# Altium project 2024_TCU.PrjPcb (part 2 of 2)

## Sheet IMU.SchDoc
size A; SheetNumber: 5; SheetTotal: 10
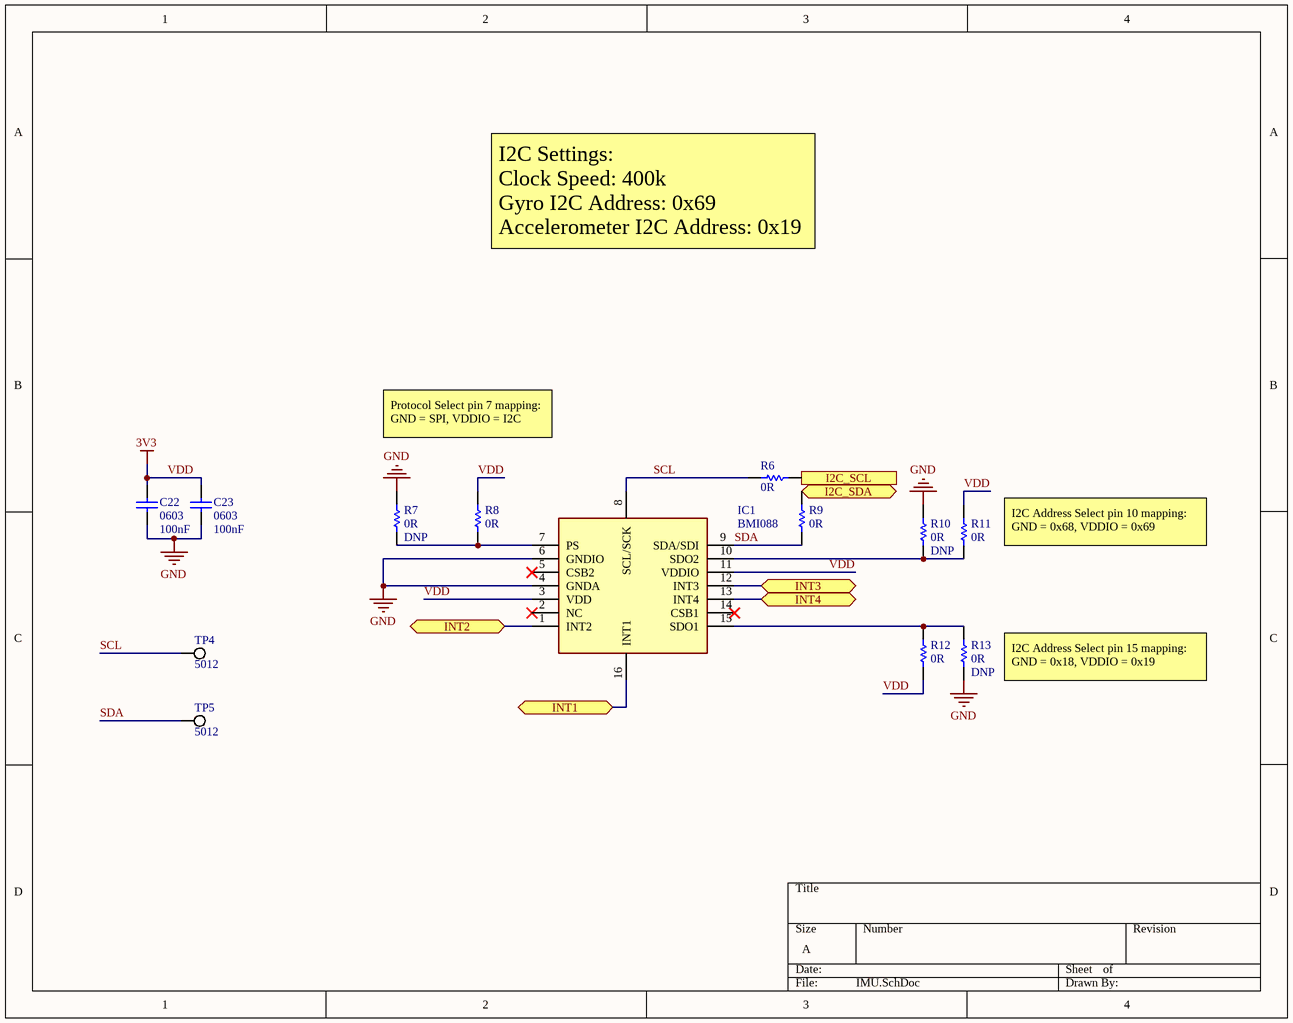
[diagram p7: IMU.SchDoc]

### Parts
C22  Case Code (Imperial): 0603  Capacitance: 100nF  [CAPC1608X87X35NL15T15]  (hidden comment: C0603X104K5RACTU)
C23  Case Code (Imperial): 0603  Capacitance: 100nF  [CAPC1608X87X35NL15T15]  (hidden comment: C0603X104K5RACTU)
IC1  BMI088  [BMI088]
R6  Resistance: 0R  [RESC2013X60X35LL10T20]  (hidden comment: RC0805JR-100RL)
R7  Resistance: 0R  [RESC2013X60X35LL10T20]  (hidden comment: RC0805JR-100RL)
R8  Resistance: 0R  [RESC2013X60X35LL10T20]  (hidden comment: RC0805JR-100RL)
R9  Resistance: 0R  [RESC2013X60X35LL10T20]  (hidden comment: RC0805JR-100RL)
R10  Resistance: 0R  [RESC2013X60X35LL10T20]  (hidden comment: RC0805JR-100RL)
R11  Resistance: 0R  [RESC2013X60X35LL10T20]  (hidden comment: RC0805JR-100RL)
R12  Resistance: 0R  [RESC2013X60X35LL10T20]  (hidden comment: RC0805JR-100RL)
R13  Resistance: 0R  [RESC2013X60X35LL10T20]  (hidden comment: RC0805JR-100RL)
TP4  5012  [KSTN-5012_V]
TP5  5012  [KSTN-5012_V]

### Ports
I2C_SCL (in, see TCU[2A], MainConnector[2C]), I2C_SDA (bidir, see TCU[2A], MainConnector[3B]), INT1 (bidir, see TCU[2A]), INT2 (bidir, see TCU[2A]), INT3 (bidir, see TCU[2A]), INT4 (bidir, see TCU[2A])

### Nets
3V3: C22.1 C23.1 IC1.3(VDD) IC1.11(VDDIO) R8.2 R11.2 R12.1  [also labelled VDD]  [project net AVDD33]
GND: C22.2 C23.2 IC1.4(GNDA) IC1.6(GNDIO) R7.2 R10.2 R13.1
SCL: IC1.8(SCL/SCK) R6.2 TP4.1
SDA: IC1.9(SDA/SDI) R9.1 TP5.1
NetIC1_1: IC1.1(INT2) ; port INT2
NetIC1_7: IC1.7(PS) R7.1 R8.1
NetIC1_10: IC1.10(SDO2) R10.1 R11.1
NetIC1_12: IC1.12(INT3) ; port INT3
NetIC1_13: IC1.13(INT4) ; port INT4
NetIC1_15: IC1.15(SDO1) R12.2 R13.2
NetIC1_16: IC1.16(INT1) ; port INT1
NetJ3_3: R6.1 ; port I2C_SCL
NetJ3_8: R9.2 ; port I2C_SDA

Not connected (* = marked no-connect by the designer): IC1 2(NC)* 5(CSB2)* 14(CSB1)*

### Notes on the sheet
- I2C Settings:
  Clock Speed: 400k
  Gyro I2C Address: 0x69
  Accelerometer I2C Address: 0x19
- Protocol Select pin 7 mapping:
  GND = SPI, VDDIO = I2C
- (near R11) I2C Address Select pin 10 mapping:
  GND = 0x68, VDDIO = 0x69
- (near R13) I2C Address Select pin 15 mapping:
  GND = 0x18, VDDIO = 0x19

### Library data of the parts
C22 C23 = CMP-2006-03300-1: Manufacturer: Kemet; Dielectric Material: Ceramic; Tolerance: 10%; Voltage Rating: 50V; Dielectric: X7R; Dissipation Factor: 2.5%; Part Number: C0603X104K5RACTU; Supplier 1: Digi-Key; Supplier Part Number 1: 399-7969-1-ND; Manufacturer Part Number: C0603X104K5RACTU; Stock 1: 2206541; Pricing 1: 1 = 0.21000, 10 = 0.14500, 100 = 0.07340, 500 = 0.05024, 1000 = 0.04444 (USD); RoHS: Yes; Mount: Surface Mount; Case/Package: 0603; Number of Pins: 2; Case Code (Metric): 1608; Min Operating Temperature: -55°C; Max Operating Temperature: 125°C; Packaging: Tape and Reel; Package Quantity: 1; Voltage Rating (DC): 50V; Termination: SMD/SMT; Voltage: 50V; Features: Soft Termination; Length: 1.6mm; Height: 0.8mm; Width: 0.8mm; Depth: 0.8mm; Thickness: 0.034inch; Radiation Hardening: No; REACH SVHC: No SVHC; ComponentLink1URL: https://datasheet.ciiva.com/7823/1776088-7823908.pdf?src-supplier=Element14; ComponentLink1Description: https://datasheet.ciiva.com/7823/1776088-7823908.pdf?src-supplier=Element14; ComponentLink2URL: https://datasheet.ciiva.com/26948/getdatasheetpartid-385607-26948458.pdf?src-supplier=Verical; ComponentLink2Description: https://datasheet.ciiva.com/26948/getdatasheetpartid-385607-26948458.pdf?src-supplier=Verical; ComponentLink3URL: https://datasheet.ciiva.com/7823/1776088-7823909.pdf?src-supplier=Element14; ComponentLink3Description: https://datasheet.ciiva.com/7823/1776088-7823909.pdf?src-supplier=Element14; ComponentLink4URL: https://datasheet.ciiva.com/6279/kem-c1013-x7r-ft-cap-smd-6279993.pdf?src-supplier=Digi-Key; ComponentLink4Description: https://datasheet.ciiva.com/6279/kem-c1013-x7r-ft-cap-smd-6279993.pdf?src-supplier=Digi-Key; ComponentLink5URL: https://datasheet.ciiva.com/28533/1918693-28533212.pdf?src-supplier=Element14; ComponentLink5Description: https://datasheet.ciiva.com/28533/1918693-28533212.pdf?src-supplier=Element14; ComponentLink6URL: https://datasheet.ciiva.com/6279/kem-c1013-x7r-ft-cap-smd-6279999.pdf?src-supplier=Digi-Key; ComponentLink6Description: https://datasheet.ciiva.com/6279/kem-c1013-x7r-ft-cap-smd-6279999.pdf?src-supplier=Digi-Key; ComponentLink7URL: https://datasheet.ciiva.com/6279/kem-c1013-x7r-ft-cap-smd-6279990.pdf?src-supplier=Digi-Key; ComponentLink7Description: https://datasheet.ciiva.com/6279/kem-c1013-x7r-ft-cap-smd-6279990.pdf?src-supplier=Digi-Key; ComponentLink8URL: https://datasheet.ciiva.com/14597/70096394-14597743.pdf?src-supplier=Allied+Electronics; ComponentLink8Description: https://datasheet.ciiva.com/14597/70096394-14597743.pdf?src-supplier=Allied+Electronics
IC1 = BMI088: Integrated Circuit; Manufacturer_Name: BOSCH; Datasheet Link: https://datasheet.datasheetarchive.com/originals/distributors/Datasheets_SAMA/994c3bf88e91a9e9fead6a819d348e4d.pdf; Height: 1.45mm; Manufacturer_Part_Number: BMI088; Mouser Part Number: 262-BMI088; Mouser Price/Stock: https://www.mouser.co.uk/ProductDetail/Bosch-Sensortec/BMI088?qs=f9yNj16SXrIMFspTV6RB6Q%3D%3D; Arrow Part Number: BMI088; Arrow Price/Stock: https://www.arrow.com/en/products/bmi088/bosch?region=europe; Supplier 1: Arrow Electronics; Supplier Part Number 1: BMI088
R6-R13 = CMP-2000-06963-1: Chip Resistor, 0 Ohm, +/- 5%, 125 mW, -55 to 155 degC, 0805 (2012 Metric), RoHS, Tape and Reel; Manufacturer: Yageo; Product Length (mm): 2mm; Tolerance (+ or -): NotRequired; Case Style: Molded; Product Height (mm): 0.5mm; Power Rating(s): NotRequiredW; Product Depth (mm): 1.25mm; Mounting Technology: SurfaceMount; Military Standard: NotRequired; Operating Temp Range: -55Cto155C; Temperature Coefficient: NotRequired; Package Description: 2-Pin Surface Mounted Device, Body 2 x 1.25 mm; Datasheet Version: Rev. 7, 05/2017; Failure Rate: NotRequired; Manufacturer URL: http://www.yageo.com/; Datasheet URL: http://www.yageo.com/documents/recent/PYu-RC_Group_51_RoHS_L_7.pdf; Packaging: TapeandReel; Package Reference: 0805; Package / Case: 0805; Termination Style: NotRequired; Type: ThickFilm; Construction: Rectangular
  R7 R10 R13: DNP: DNP
TP4 TP5 = CMP-1672-00004-4: Test Point, White, Through Hole, RoHS, Bulk; Manufacturer: Keystone; DatasheetVersion: Rev. F, 12/2013; ComponentLink1URL: http://www.keyelco.com/; PackageReference: 5012; RoHSCompliant: true; ComponentLink2Description: Datasheet; Colour: White; Contact Material: Bronze; PackageDescription: 1-Pin Through Hole Device, Dia 3.17 mm; Mounting Technology: Through Hole; Mount: Through Hole; Package Quantity: 100; ComponentLink1Description: Manufacturer URL; Pins: 1; Height: 8.12 mm; Packaging: Bulk; REACH SVHC: No SVHC; Contact Plating: Silver; Length: 11.3 mm; ComponentLink2URL: http://www.keyelco.com/product-pdf.cfm?p=1321

## Sheet Ethernet.SchDoc
size Legal; SheetNumber: 7; SheetTotal: 10
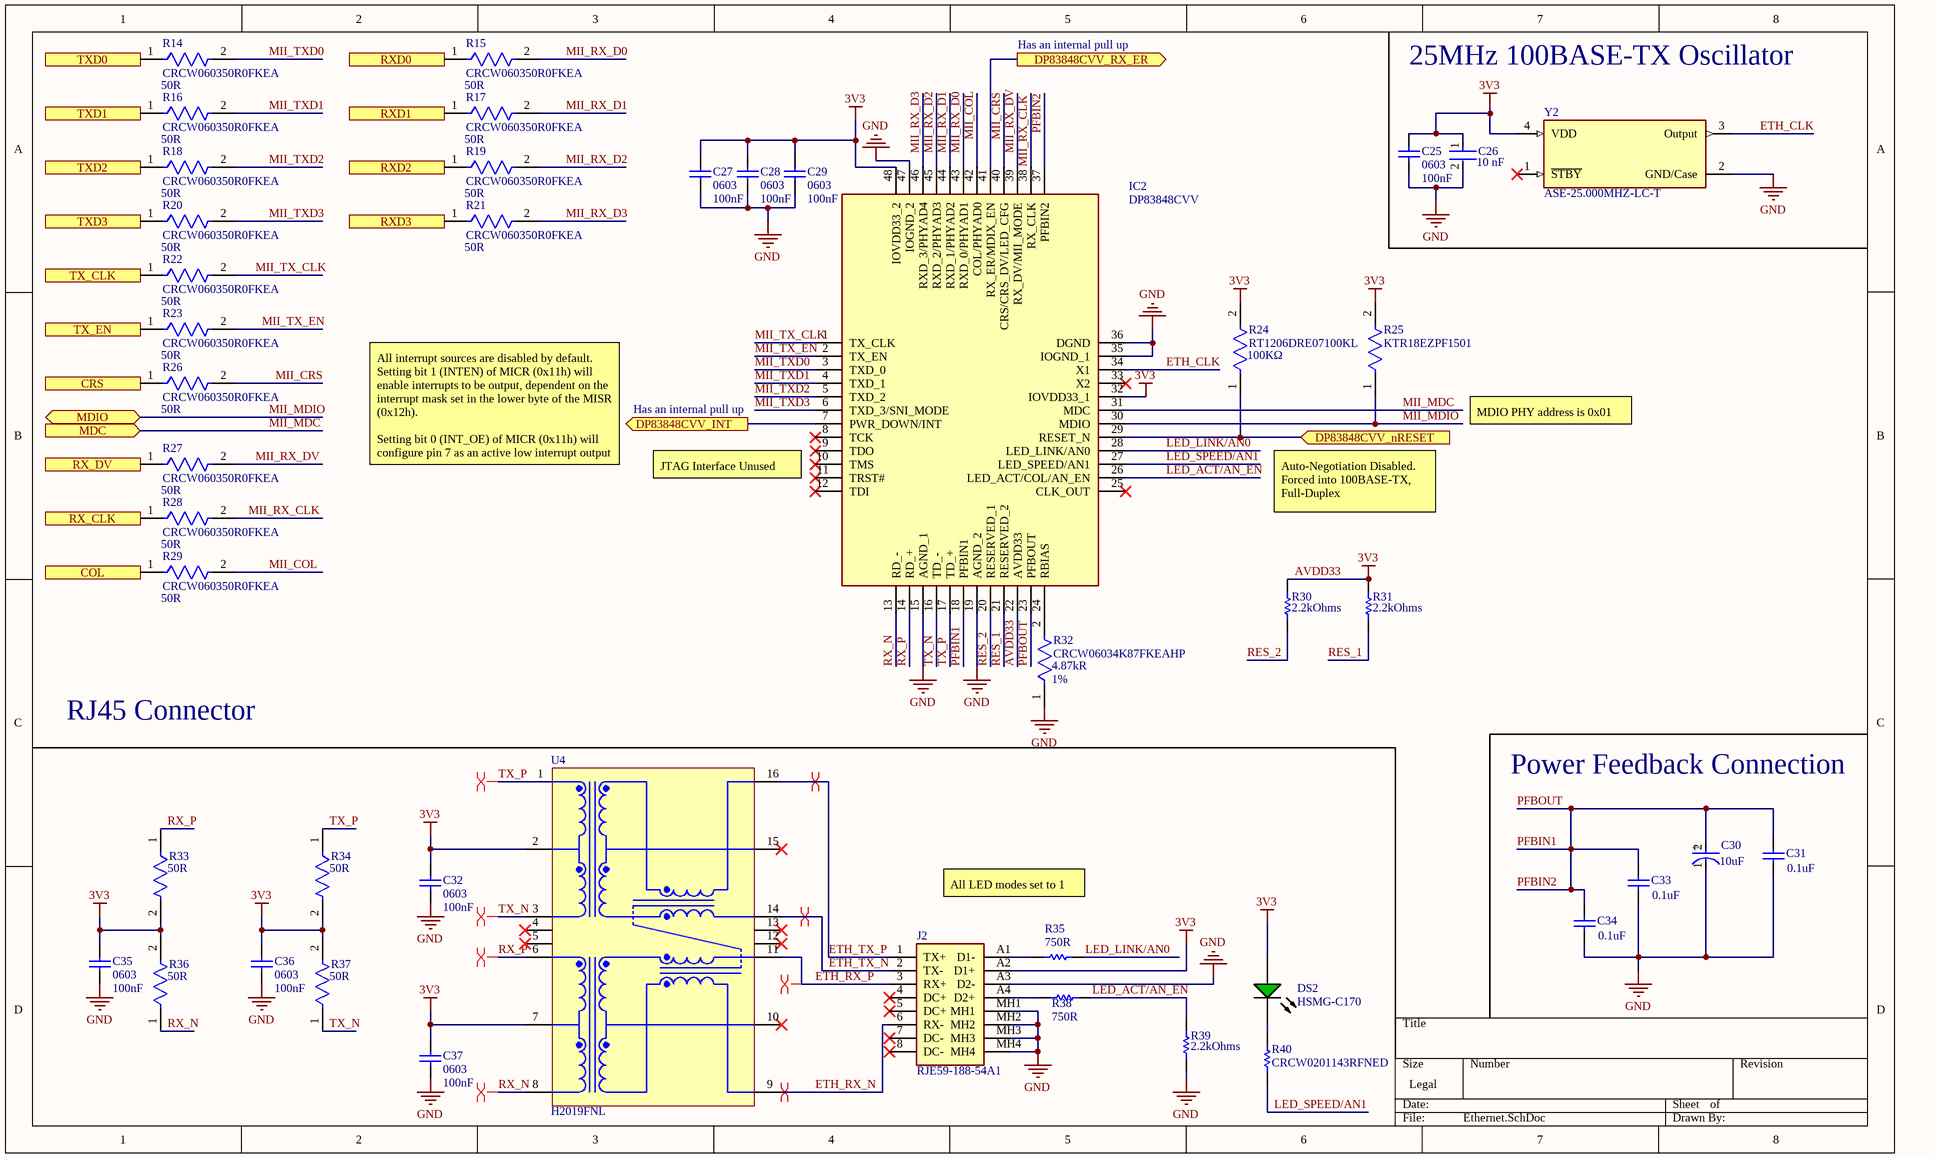
[diagram p8: Ethernet.SchDoc]

### Parts
C25  Case Code (Imperial): 0603  Capacitance: 100nF  [CAPC1608X87X35NL15T15]  (hidden comment: C0603X104K5RACTU)
C26  value 10 nF  [FP-CC0603-DA-MFG]  (hidden comment: CC0603KRX7R9BB103)
C27  Case Code (Imperial): 0603  Capacitance: 100nF  [CAPC1608X87X35NL15T15]  (hidden comment: C0603X104K5RACTU)
C28  Case Code (Imperial): 0603  Capacitance: 100nF  [CAPC1608X87X35NL15T15]  (hidden comment: C0603X104K5RACTU)
C29  Case Code (Imperial): 0603  Capacitance: 100nF  [CAPC1608X87X35NL15T15]  (hidden comment: C0603X104K5RACTU)
C30  Capacitance: 10uF  [FP-T491B106K025AT-MFG]  (hidden comment: T491B106K025AT)
C31  value 0.1uF  [CAPC2113X120X50NL20T30]  (hidden comment: TAJR104K020RNJ)
C32  Case Code (Imperial): 0603  Capacitance: 100nF  [CAPC1608X87X35NL15T15]  (hidden comment: C0603X104K5RACTU)
C33  value 0.1uF  [CAPC2113X120X50NL20T30]  (hidden comment: TAJR104K020RNJ)
C34  value 0.1uF  [CAPC2113X120X50NL20T30]  (hidden comment: TAJR104K020RNJ)
C35  Case Code (Imperial): 0603  Capacitance: 100nF  [CAPC1608X87X35NL15T15]  (hidden comment: C0603X104K5RACTU)
C36  Case Code (Imperial): 0603  Capacitance: 100nF  [CAPC1608X87X35NL15T15]  (hidden comment: C0603X104K5RACTU)
C37  Case Code (Imperial): 0603  Capacitance: 100nF  [CAPC1608X87X35NL15T15]  (hidden comment: C0603X104K5RACTU)
DS2  HSMG-C170  [AVAG-HSMX-C170_V]
IC2  DP83848CVV  [QFP50P900X900X160-48N]
J2  RJE59-188-54A1  [RJE5918854A1]
R14  CRCW060350R0FKEA  Resistance: 50R  [FP-CRCW0603-e3-MFG]
R15  CRCW060350R0FKEA  Resistance: 50R  [FP-CRCW0603-e3-MFG]
R16  CRCW060350R0FKEA  Resistance: 50R  [FP-CRCW0603-e3-MFG]
R17  CRCW060350R0FKEA  Resistance: 50R  [FP-CRCW0603-e3-MFG]
R18  CRCW060350R0FKEA  Resistance: 50R  [FP-CRCW0603-e3-MFG]
R19  CRCW060350R0FKEA  Resistance: 50R  [FP-CRCW0603-e3-MFG]
R20  CRCW060350R0FKEA  Resistance: 50R  [FP-CRCW0603-e3-MFG]
R21  CRCW060350R0FKEA  Resistance: 50R  [FP-CRCW0603-e3-MFG]
R22  CRCW060350R0FKEA  Resistance: 50R  [FP-CRCW0603-e3-MFG]
R23  CRCW060350R0FKEA  Resistance: 50R  [FP-CRCW0603-e3-MFG]
R24  RT1206DRE07100KL  Resistance: 100KΩ  [FP-RT1206-MFG]
R25  KTR18EZPF1501  [FP-KTR18-IPC_C]
R26  CRCW060350R0FKEA  Resistance: 50R  [FP-CRCW0603-e3-MFG]
R27  CRCW060350R0FKEA  Resistance: 50R  [FP-CRCW0603-e3-MFG]
R28  CRCW060350R0FKEA  Resistance: 50R  [FP-CRCW0603-e3-MFG]
R29  CRCW060350R0FKEA  Resistance: 50R  [FP-CRCW0603-e3-MFG]
R30  Resistance: 2.2kOhms  [RESC1608X55X25LL10T15]  (hidden comment: RC0603FR-072K2L)
R31  Resistance: 2.2kOhms  [RESC1608X55X25LL10T15]  (hidden comment: RC0603FR-072K2L)
R32  CRCW06034K87FKEAHP  Tolerance: 1%  Resistance: 4.87kR  [FP-CRCW0603-HPe3-MFG]
R33  Resistance: 50R  [FP-CRCW0603-e3-MFG]  (hidden comment: CRCW060350R0FKEA)
R34  Resistance: 50R  [FP-CRCW0603-e3-MFG]  (hidden comment: CRCW060350R0FKEA)
R35  Resistance: 750R  [RESC1609X50X30ML10T20]  (hidden comment: CRCW0603750RJNEA)
R36  Resistance: 50R  [FP-CRCW0603-e3-MFG]  (hidden comment: CRCW060350R0FKEA)
R37  Resistance: 50R  [FP-CRCW0603-e3-MFG]  (hidden comment: CRCW060350R0FKEA)
R38  Resistance: 750R  [RESC1609X50X30ML10T20]  (hidden comment: CRCW0603750RJNEA)
R39  Resistance: 2.2kOhms  [RESC1608X55X25LL10T15]  (hidden comment: RC0603FR-072K2L)
R40  CRCW0201143RFNED  [RESC0603X28X15ML05T05]
U4  H2019FNL  [PULS-H2019FNL_V]
Y2  ASE-25.000MHZ-LC-T  [FP-ASE-MFG]

### Ports
COL (out, see TCU[2C]), CRS (out, see TCU[2C]), DP83848CVV_INT (out, see TCU[2D], Processor[3C]), DP83848CVV_nRESET (in, see TCU[2D], Processor[2D]), DP83848CVV_RX_ER (out, see TCU[2D], Processor[2A]), MDC (in, see TCU[2C]), MDIO (bidir, see TCU[2C]), RX_CLK (out, see TCU[2C]), RX_DV (out, see TCU[2C]), RXD0 (out, see TCU[2C]), RXD1 (out, see TCU[2C]), RXD2 (out, see TCU[2D]), RXD3 (out, see TCU[2D]), TX_CLK (out, see TCU[2C]), TX_EN (in, see TCU[2C]), TXD0 (in, see TCU[2C]), TXD1 (in, see TCU[2C]), TXD2 (in, see TCU[2C]), TXD3 (in, see TCU[2C])

### Nets
AVDD33: C25.1 C26.1 C27.1 C28.1 C29.1 C32.1 C35.1 C36.1 C37.1 DS2.1(A) IC2.22(AVDD33) IC2.32(IOVDD33_1) IC2.48(IOVDD33_2) J2.A2(D1+) R24.2 R25.2 R30.2 R31.2 R33.2 R34.2 R36.2 R37.2 U4.2(TCT) U4.7(RCT) Y2.4(VDD)  [also labelled 3V3]
GND: C25.2 C26.2 C27.2 C28.2 C29.2 C30.1(C) C31.1 C32.2 C33.1 C34.1 C35.2 C36.2 C37.2 IC2.15(AGND_1) IC2.19(AGND_2) IC2.35(IOGND_1) IC2.36(DGND) IC2.47(IOGND_2) J2.A3(D2-) J2.MH1 J2.MH2 J2.MH3 J2.MH4 R32.1 R39.1 Y2.2(GND/Case)
ETH_CLK: IC2.34(X1) Y2.3(Output)
ETH_RX_N: J2.6(RX-) U4.9(RX-)
ETH_RX_P: J2.3(RX+) U4.11(RX+)
ETH_TX_N: J2.2(TX-) U4.14(TX-)
ETH_TX_P: J2.1(TX+) U4.16(TX+)
LED_ACT/AN_EN: IC2.26(LED_ACT/COL/AN_EN) R38.2 R39.2
LED_LINK/AN0: IC2.28(LED_LINK/AN0) R35.2
LED_SPEED/AN1: IC2.27(LED_SPEED/AN1) R40.1
MII_COL: IC2.42(COL/PHYAD0) R29.2
MII_CRS: IC2.40(CRS/CRS_DV/LED_CFG) R26.2
MII_MDC: IC2.31(MDC) ; port MDC
MII_MDIO: IC2.30(MDIO) R25.1 ; port MDIO
MII_RX_CLK: IC2.38(RX_CLK) R28.2
MII_RX_D0: IC2.43(RXD_0/PHYAD1) R15.2
MII_RX_D1: IC2.44(RXD_1/PHYAD2) R17.2
MII_RX_D2: IC2.45(RXD_2/PHYAD3) R19.2
MII_RX_D3: IC2.46(RXD_3/PHYAD4) R21.2
MII_RX_DV: IC2.39(RX_DV/MII_MODE) R27.2
MII_TX_CLK: IC2.1(TX_CLK) R22.2
MII_TX_EN: IC2.2(TX_EN) R23.2
MII_TXD0: IC2.3(TXD_0) R14.2
MII_TXD1: IC2.4(TXD_1) R16.2
MII_TXD2: IC2.5(TXD_2) R18.2
MII_TXD3: IC2.6(TXD_3/SNI_MODE) R20.2
PFBIN1: C30.2(A) C31.2 C33.2 C34.2 IC2.18(PFBIN1) IC2.23(PFBOUT) IC2.37(PFBIN2)  [also labelled PFBIN2, PFBOUT]
RES_1: IC2.21(RESERVED_2) R31.1
RES_2: IC2.20(RESERVED_1) R30.1
RX_N: IC2.13(RD_-) R36.1 U4.8(RD-)
RX_P: IC2.14(RD_+) R33.1 U4.6(RD+)
TX_N: IC2.16(TD_-) R37.1 U4.3(TD-)
TX_P: IC2.17(TD_+) R34.1 U4.1(TD+)
NetDS2_2: DS2.2(K) R40.2
NetIC2_7: IC2.7(PWR_DOWN/INT) ; port DP83848CVV_INT
NetIC2_24: IC2.24(RBIAS) R32.2
NetIC2_29: IC2.29(RESET_N) R24.1 ; port DP83848CVV_nRESET
NetIC2_41: IC2.41(RX_ER/MDIX_EN) ; port DP83848CVV_RX_ER
NetJ2_A1: J2.A1(D1-) R35.1
NetJ2_A4: J2.A4(D2+) R38.1
NetR14_1: R14.1 ; port TXD0
NetR15_1: R15.1 ; port RXD0
NetR16_1: R16.1 ; port TXD1
NetR17_1: R17.1 ; port RXD1
NetR18_1: R18.1 ; port TXD2
NetR19_1: R19.1 ; port RXD2
NetR20_1: R20.1 ; port TXD3
NetR21_1: R21.1 ; port RXD3
NetR22_1: R22.1 ; port TX_CLK
NetR23_1: R23.1 ; port TX_EN
NetR26_1: R26.1 ; port CRS
NetR27_1: R27.1 ; port RX_DV
NetR28_1: R28.1 ; port RX_CLK
NetR29_1: R29.1 ; port COL

Not connected (* = marked no-connect by the designer): IC2 8(TCK)* 9(TDO)* 10(TMS)* 11(TRST#)* 12(TDI)* 25(CLK_OUT)* 33(X2)*; J2 4(DC+)* 5(DC+)* 7(DC-)* 8(DC-)*; U4 4(NC)* 5(NC)* 10(RXCT)* 12(NC)* 13(NC)* 15(TXCT)*; Y2 1(~{STBY})*

### Layout directives
differential pair: ETH_RX_N, ETH_RX_P, ETH_TX_N, ETH_TX_P, RX_N, RX_P, TX_N, TX_P

### Notes on the sheet
- Has an internal pull up
- 25MHz 100BASE-TX Oscillator
- MDIO PHY address is 0x01
- All interrupt sources are disabled by default. Setting bit 1 (INTEN) of MICR (0x11h) will enable interrupts to be output, dependent on the interrupt mask set in the lower byte of the MISR (0x12h).
  Setting bit 0 (INT_OE) of MICR (0x11h) will configure pin 7 as an active low interrupt output
- (near IC2) JTAG Interface Unused
- Auto-Negotiation Disabled. Forced into 100BASE-TX, Full-Duplex
- RJ45 Connector
- Power Feedback Connection
- All LED modes set to 1
- (in symbol CMP-03017-000036-1) +

### Library data of the parts
C25 C27-C29 C32 C35-C37 = CMP-2006-03300-1: as C22 on sheet IMU; Part Number: C0603X104K5RACTU; Supplier 1: Digi-Key; Supplier Part Number 1: 399-7969-1-ND; Manufacturer Part Number: C0603X104K5RACTU; Stock 1: 2206541; Pricing 1: 1 = 0.21000, 10 = 0.14500, 100 = 0.07340, 500 = 0.05024, 1000 = 0.04444 (USD); RoHS: Yes; Mount: Surface Mount; Case/Package: 0603; Number of Pins: 2; Case Code (Metric): 1608; Min Operating Temperature: -55°C; Max Operating Temperature: 125°C; Packaging: Tape and Reel; Package Quantity: 1; Voltage Rating (DC): 50V; Termination: SMD/SMT; Voltage: 50V; Features: Soft Termination; Length: 1.6mm; Height: 0.8mm; Width: 0.8mm; Depth: 0.8mm; Thickness: 0.034inch; Radiation Hardening: No; REACH SVHC: No SVHC; ComponentLink1URL: https://datasheet.ciiva.com/7823/1776088-7823908.pdf?src-supplier=Element14; ComponentLink1Description: https://datasheet.ciiva.com/7823/1776088-7823908.pdf?src-supplier=Element14; ComponentLink2URL: https://datasheet.ciiva.com/26948/getdatasheetpartid-385607-26948458.pdf?src-supplier=Verical; ComponentLink2Description: https://datasheet.ciiva.com/26948/getdatasheetpartid-385607-26948458.pdf?src-supplier=Verical; ComponentLink3URL: https://datasheet.ciiva.com/7823/1776088-7823909.pdf?src-supplier=Element14; ComponentLink3Description: https://datasheet.ciiva.com/7823/1776088-7823909.pdf?src-supplier=Element14; ComponentLink4URL: https://datasheet.ciiva.com/6279/kem-c1013-x7r-ft-cap-smd-6279993.pdf?src-supplier=Digi-Key; ComponentLink4Description: https://datasheet.ciiva.com/6279/kem-c1013-x7r-ft-cap-smd-6279993.pdf?src-supplier=Digi-Key; ComponentLink5URL: https://datasheet.ciiva.com/28533/1918693-28533212.pdf?src-supplier=Element14; ComponentLink5Description: https://datasheet.ciiva.com/28533/1918693-28533212.pdf?src-supplier=Element14; ComponentLink6URL: https://datasheet.ciiva.com/6279/kem-c1013-x7r-ft-cap-smd-6279999.pdf?src-supplier=Digi-Key; ComponentLink6Description: https://datasheet.ciiva.com/6279/kem-c1013-x7r-ft-cap-smd-6279999.pdf?src-supplier=Digi-Key; ComponentLink7URL: https://datasheet.ciiva.com/6279/kem-c1013-x7r-ft-cap-smd-6279990.pdf?src-supplier=Digi-Key; ComponentLink7Description: https://datasheet.ciiva.com/6279/kem-c1013-x7r-ft-cap-smd-6279990.pdf?src-supplier=Digi-Key; ComponentLink8URL: https://datasheet.ciiva.com/14597/70096394-14597743.pdf?src-supplier=Allied+Electronics; ComponentLink8Description: https://datasheet.ciiva.com/14597/70096394-14597743.pdf?src-supplier=Allied+Electronics
C26 = CMP-2100-03600-2: CAP CER 10000PF 50V X7R 0603; Manufacturer: YAGEO; Tolerance: 0.1; Material: Ceramic; Temperature Coefficient: 15%; Mouser Description: Multilayer Ceramic Capacitor, CC Series, 0.01 - F, - 10%, X7R, 50 V, 0603 [1608 Metric]; Digikey Description: CAP CER 10000PF 50V X7R 0603; Height: 0.9mm; Category: Cap; Temperature Characteristic: X7R; Footprint Url: http://www.yageo.com/exep/pages/download/literatures/UPY-C_GEN_24.pdf; Lead Free: Yes; Voltage Rating: 50 V; Manufacturer Part Number: CC0603KRX7R9BB103; Temperature: -55°C to +125°C; Device Class L3: Ceramic Capacitors; ComponentLink2Description: Datasheet; Voltage: 50 V; Package: CC0603-DA; Octopart: https://octopart.com/cc0603krx7r9bb103-yageo-192938; Automotive: No; Temperature Range High: +125°C; Temperature Range Low: -55°C; RoHS: TRUE; Device Class L1: Passive Components; ComponentLink2URL: http://www.yageo.com/documents/recent/UPY-GPHC_X7R_6.3V-to-50V_18.pdf; Device Class L2: Capacitors; Capacitance: 10 nF
C30 = CMP-03017-000036-1: CAP TANT 10UF 10% 25V 1411; Life (Hours): 2000Hour; Leakage Current: 2.5uA; ESR (Equivalent Series Resistance): 3R; Ripple Current: 168mA; Polarity: Polar; Dielectric Material: Tantalum; Dissipation Factor: 8%; Package Quantity: 1; Series: T491; Features: General Purpose; Lead Free: Lead Free; Termination: SMD/SMT; Packaging: Tape and Reel; Max Operating Temperature: 125°C; Number of Pins: 2; Case Code (Imperial): 1411; Height - Seated (Max): 0.083inch; Min Operating Temperature: -55°C; Case/Package: 1411; Voltage: 25V; Tolerance: 10%; REACH SVHC: No SVHC; Case Code (Metric): 3528; Depth: 2.8mm; Mount: Surface Mount; Voltage Rating (DC): 25V; Length: 3.5mm; Voltage Rating: 25V; Construction: Flat; RoHS Compliant: Yes; Height: 1.9mm; Width: 0.11inch; Radiation Hardening: No
C31 C33 C34 = CMP-2007-04027-1: Manufacturer: AVX Interconnect / Elco; Part Number: TAJR104K020RNJ
DS2 = CMP-2000-05062-1: Chip LED, Green, 2.2 V, -40 to 85 degC, 2-Pin SMD, Pb-Free, Tape and Reel; Manufacturer: Avago; No. of Pins: 2; Peak Wavelength: 570nm; SVHC: NoSVHC(16-Jun-2014); Dominant Wavelength: 572nm; Forward Current If: 20mA; Viewing Angle: 170deg; Lens Shape: Rectangular; PIV Max: 5V; External Width: 1.25mm; LED Type: Standard; External Depth: 0.8mm; Opto Mounting Orientation: Top; Luminous Intensity: 15mcd; Luminous Intensity Min: 4mcd; Forward Voltage VF Max: 2.6V; External Length / Height: 2mm; Bulb Size: 1.25mmx1.4mm; Light Area Height: 1mm; Voltage Vf Typ: 2.2V; Operating Temperature Max: 85degC; Datasheet Version: Oct-08; MSL: MSL2A-4weeks; Peak Forward Current: 20mA; Package Description: 2-Pin Surface Mount Device, Body 2 x 1.25 mm, Height 0.8 mm; Datasheet URL: https://datasheet.ciiva.com/29280/180495-da-01-en-chip-led-hsmg-c170-gelb-gruen-29280971.pdf; Storage Temperature Min: -40degC; LED Colour: Green; Wavelength Typ: 570nm; Mounting Type: SMD; Forward Current If Max: 20mA; Dominant Wavelength Typ: 572nm; LED Mounting: SMD; Operating Temperature Range: -30degCto+85degC; Operating Temperature Min: -30degC; Manufacturer URL: http://www.avagotech.com/; Packaging: CutTape; Luminous Intensity Typ: 15mcd; Package Reference: HSMX-C170; Storage Temperature Max: 85degC; Opto Case Style: SMD; Forward Voltage: 2.2V
IC2 = DP83848CVV: Integrated Circuit; Manufacturer_Name: Texas Instruments; Datasheet Link: https://www.ti.com/lit/ds/symlink/dp83848c.pdf?ts=1623408916131&ref_url=https%253A%252F%252Fwww.ti.com%252Fstore%252Fti%252Fen%252Fp%252Fproduct%252F%253Fp%253DDP83848CVV%252FNOPB; Height: 1.6mm; Manufacturer_Part_Number: DP83848CVV; Mouser Part Number: N/A; Mouser Price/Stock: https://www.mouser.co.uk/ProductDetail/Texas-Instruments/DP83848CVV?qs=7X5t%252BdzoRHD7qwP%2FAptr%2Fg%3D%3D; Supplier 1: Mouser; Supplier Part Number 1: 926-DP83848CVV/NOPB
J2 = RJE59-188-54A1: Connector; Manufacturer_Name: Amphenol; Datasheet Link: https://datasheet.datasheetarchive.com/originals/distributors/DKDS-29/572439.pdf; Height: 14.99mm; Manufacturer_Part_Number: RJE59-188-54A1; Mouser Part Number: 523-RJE59-188-54A1; Mouser Price/Stock: https://www.mouser.co.uk/ProductDetail/Amphenol-Commercial-Products/RJE59-188-54A1?qs=cbcdnthhinTKLWQ%2FS%2FbVLA%3D%3D; Supplier 1: Avnet; Supplier Part Number 1: 92Y3914
R14-R23 R26-R29 R33 R34 R36 R37 = CMP-2000-03436-2: RES Thick Film, 50Ω, 1%, 0.1W, 100ppm/°C, 0603; Voltage Rating (DC): 75V; Power Rating: 100mW; Case/Package: 0603; Packaging: Tape and Reel; Military Standard: Not; REACH SVHC: No SVHC; Width: 0.85mm; Max Operating Temperature: 155°C; Case Code (Metric): 1608; Temperature Coefficient: 100ppm/°C; Lead Free: Lead Free; Height: 0.45mm; Composition: Thick Film; Termination: SMD/SMT; Contact Plating: Tin; Number of Pins: 2; Tolerance: 1%; Depth: 0.85mm; Weight: 7.1E-05oz; Min Operating Temperature: -55°C; Length: 1.55mm; Radiation Hardening: No; Voltage Rating: 75V; Case Code (Imperial): 0603; Package Quantity: 5000; Mount: Surface Mount
R24 = CMP-2003-04271-2: RES SMD 100K OHM 0.5% 1/4W 1206; Manufacturer: Yageo; Value: 100KΩ; Power Rating: 0.25W; Tolerance: 0.0001; Temperature Coefficient: 50 ppm/°C; Voltage Rating: 200V; Mouser Description: Res Thin Film 1206 100K Ohm 0.5% 1/4W ±50ppm/°C Molded SMD Paper T/R; Series: RT; RoHS: TRUE; Device Class L3: Chip SMD Resistors; Ipc Land Pattern Name: RESC310160X55; Lead Free: Yes; Package: RT1206; Height: 0.65mm; Composition: Thin Film; Temperature Range Low: -55°C; Device Class L2: Resistors; Octopart: https://octopart.com/rt1206dre07100kl-yageo-1189867; ComponentLink2Description: Datasheet; ComponentLink2URL: http://www.yageo.com/documents/recent/PYu-RT_1-to-0.01_RoHS_L_9.pdf; Digikey Description: RES SMD 100K OHM 0.5% 1/4W 1206; Manufacturer Part Number: RT1206DRE07100KL; Temperature Range High: +155°C; Automotive: No; Temperature: -55°C to +155°C; Device Class L1: Passive Components; Footprint Url: http://www.yageo.com/exep/pages/download/literatures/PYu-R_Mount_10.pdf; Category: Res
R25 = CMP-08839-031800-1: Res Thick Film 1206 1.5kΩ 1% 0.1W ±100ppm/°C Automotive Paper T/R; Resistance: 1.5kR; Max Power Dissipation: 250mW; Width: 0.063inch; Length: 0.126inch; Case Code (Imperial): 1206; Max Operating Temperature: 155°C; Package Quantity: 1; Case Code (Metric): 3216; RoHS Compliant: Yes; Features: Automotive AEC-Q200; Height: 0.026inch; Min Operating Temperature: -55°C; Series: KTR; Resistor Type: Thick Film; Temperature Coefficient: 100ppm/°C; Packaging: Tape and Reel; Number of Terminations: 2; Tolerance: 1%; Case/Package: 1206
R30 R31 R39 = CMP-2000-06934-1: Thick Film Resistor, 2.2 KOhm, 100 mW, 50 V, +/- 1%, -55 to 155 degC, 2-Pin SMD (0603), RoHS, Tape and Reel; Manufacturer: Yageo; Temperature Coefficient: 100PPM/C; Voltage Rating: 50V; Power Rating: 100mW; Tolerance: 1%; Datasheet Version: Rev. 7, 05/2017; Case Code - mm: 1608; Series: RC; Mounting Technology: SurfaceMount; Package Description: 2-Pin Surface Mount Device, Body 1.6 x 0.8 mm; Case Code - in: 0603; Package Reference: 0603; Product: ThickFilmResistorsGeneralPurpose; Manufacturer URL: http://www.yageo.com/; Termination Style: SMD/SMT; Operating Temperature Range: -55Cto+155C; Datasheet URL: http://www.yageo.com/documents/recent/PYu-RC_Group_51_RoHS_L_7.pdf; Packaging: Reel
R32 = CMP-02407-007715-1: RES Thick Film, 4.87kΩ, 1%, 0.33W, 100ppm/°C, 0603; Max Power Dissipation: 250mW; Package Quantity: 5000; Height: 0.022inch; Number of Terminations: 2; Termination: Wraparound; Min Operating Temperature: -55°C; Lead Free: Lead Free; Power Rating: 250mW; Features: Automotive AEC-Q200; Mount: Surface Mount; Temperature Coefficient: 100ppm/°C; Width: 0.033inch; Length: 0.063inch; Packaging: Tape and Reel; Case/Package: 0603; Max Operating Temperature: 155°C; Contact Plating: Tin; Composition: Thick Film
R35 R38 = CMP-2000-03570-1: Manufacturer: Vishay Dale; Part Number: CRCW0603750RJNEA
R40 = CMP-2004-00107-1: Manufacturer: Vishay Dale; Part Number: CRCW0201143RFNED
U4 = CMP-2000-06384-1: Telecom Transformer, 100BASE-TX, 0 to 70 degC, 16-Pin SMD, RoHS; Manufacturer: Pulse Electronics; Other Names: 553-2199; Other Related Documents: PackagesFNLvs.NL; Mounting Technology: SurfaceMount; Manufacturer URL: http://www.pulseelectronics.com/; Package Description: 16-Pin Surface Mount Device, Body 12.7 x 9.09 mm, Pitch 1.27 mm; Package Reference: H2019FNL; Standard Package: 40; Datasheet Version: Rev. A, 06/2014; Category: Transformers; Family: PulseTransformers; Datasheet URL: http://productfinder.pulseeng.com/products/datasheets/H2019FNL.pdf
Y2 = CMP-2000-05795-3: XTAL Oscillator 25MHz ±50ppm CMOS 3.3V 4-SMD 3.2mm x 2.5mm; Load Capacitance: 15pF; Min Supply Voltage: 3.135V; Max Supply Voltage: 3.465V; Max Supply Current: 13mA; Max Operating Temperature: 85°C; Termination: SMD/SMT; Operating Frequency: 25 MHz; Height: 0.047inch; Frequency: 25MHz; Mount: Surface Mount; Number of Pins: 4; Length: 3.2mm; Packaging: Tape and Reel; Frequency Stability: 50ppm; Series: ASE; Radiation Hardening: No; Package Quantity: 1000; Width: 2.5mm; Min Operating Temperature: -40°C; Lead Free: Lead Free; Case/Package: SMD/SMT; Depth: 2.5mm; Operating Supply Voltage: 3.3V

## Sheet Power.SchDoc
size A; SheetNumber: 10; SheetTotal: 10
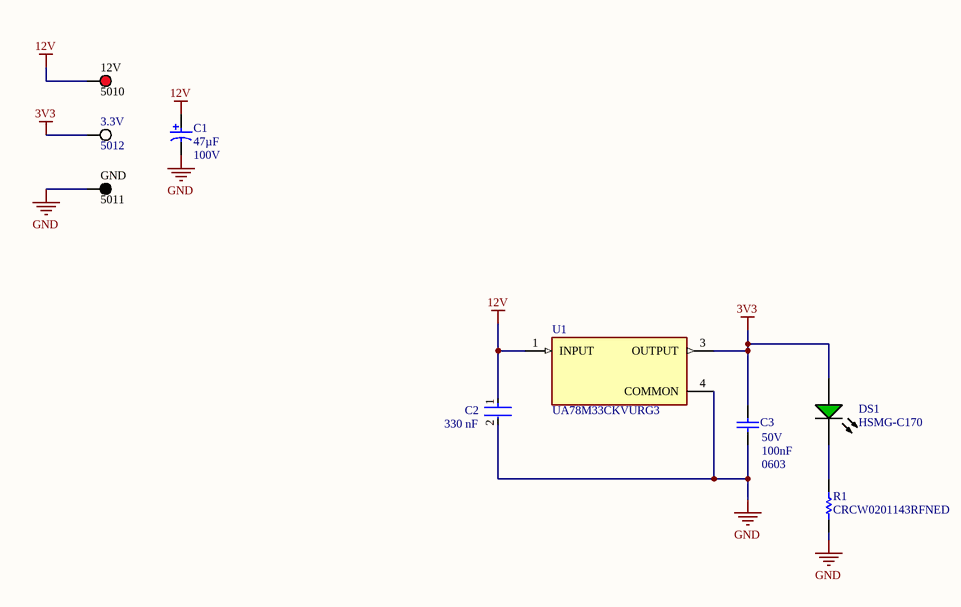
[diagram p9: Power.SchDoc]

### Parts
3.3V  5012  [KSTN-5012_V]
12V  5010  [KSTN-5010_V]
C1  Capacitance: 47µF  Voltage: 100V  [NIC-UUX2A470MNL1GS_L]  (hidden comment: UUX2A470MNL1GS)
C2  value 330 nF  [FP-CC0805-0_85-MFG]  (hidden comment: CC0805KKX7R7BB334)
C3  Case Code (Imperial): 0603  Capacitance: 100nF  Voltage: 50V  [CAPC1608X87X35NL15T15]  (hidden comment: C0603X104K5RACTU)
DS1  HSMG-C170  [AVAG-HSMX-C170_V]
GND  5011  [KSTN-5011_V]
R1  CRCW0201143RFNED  [RESC0603X28X15ML05T05]
U1  UA78M33CKVURG3  [FP-KVU0003A-MFG]

### Nets
3V3: 3.3V.1 C3.2 DS1.1(A) U1.3(OUTPUT)  [project net AVDD33]
12V: 12V.1 C1.1 C2.1 U1.1(INPUT)
GND: C1.2 C2.2 C3.1 GND.1 R1.1 U1.4(COMMON)
NetDS1_2: DS1.2(K) R1.2

### Library data of the parts
3.3V = CMP-1672-00004-4: as TP4 on sheet IMU; DatasheetVersion: Rev. F, 12/2013; ComponentLink1URL: http://www.keyelco.com/; PackageReference: 5012; RoHSCompliant: true; ComponentLink2Description: Datasheet; Colour: White; Contact Material: Bronze; PackageDescription: 1-Pin Through Hole Device, Dia 3.17 mm; Mounting Technology: Through Hole; Mount: Through Hole; Package Quantity: 100; ComponentLink1Description: Manufacturer URL; Pins: 1; Height: 8.12 mm; Packaging: Bulk; REACH SVHC: No SVHC; Contact Plating: Silver; Length: 11.3 mm; ComponentLink2URL: http://www.keyelco.com/product-pdf.cfm?p=1321
12V = CMP-1672-00002-4: Test Point, Red, Through Hole, RoHS, Bulk; Manufacturer: Keystone; Contact Material: Bronze; Mounting Technology: Through Hole; RoHSCompliant: true; Pins: 1; Package Quantity: 100; ComponentLink2Description: Datasheet; Height: 8.12 mm; ComponentLink1URL: http://www.keyelco.com/; DatasheetVersion: Rev. F, 12/2013; Mount: Through Hole; PackageReference: 5010; Contact Plating: Silver; Packaging: Bulk; Colour: Red; REACH SVHC: No SVHC; PackageDescription: 1-Pin Through Hole Device, Dia 3.17 mm; ComponentLink2URL: http://www.keyelco.com/product-pdf.cfm?p=1319; ComponentLink1Description: Manufacturer URL
C1 = CMP-2000-07372-1: Aluminum Electrolytic Capacitor, 47 uF, +/- 20%, 100 VDC, -55 to 105 degC, 2-Pin SMD, RoHS, Tape and Reel; Manufacturer: Nichicon; Type: Can; Leakage Current: 141uA; Dissipation Factor: 0.08%; Ripple Current: 230mA; Life (Hours): 2000Hour; Lead Diameter: 1.1mm; Dielectric Material: Aluminium; Polarity: Polarized; Tan Delta: 0.08; Package Description: 2-Pin Aluminum Electrolytic Capacitor, Body 10.3 x 10.3 mm; Datasheet Version: 08/2015; Case Size/Dimension: Ø10x10mm; Mounting Technology: SurfaceMount; Operating Temp-Max: 105°C; Datasheet URL: http://products.nichicon.co.jp/en/pdf/XJA043/e-uux.pdf; Manufacturer URL: http://www.nichicon.co.jp/english/; Package Reference: UUX2A470MNL1GS; Rated Voltage: 100V; Supplier 1: Digi-Key; Supplier Part Number 1: 493-9631-1-ND; Manufacturer Part Number: UUX2A470MNL1GS; Stock 1: 24372; Pricing 1: 1 = 0.720000, 10 = 0.507000, 100 = 0.333800 (USD); RoHS: Yes; Mount: Surface Mount; Case/Package: Radial; Min Operating Temperature: -55°C; Max Operating Temperature: 105°C; Tolerance: 20%; Packaging: Tape and Reel; Voltage Rating: 100V; Voltage Rating (DC): 100V; Termination: SMD/SMT; Package Quantity: 500; Ripple Current (AC): 230mA; Features: General Purpose; Diameter: 10mm; Length: 10mm; Height: 10mm; Height - Seated (Max): 0.394inch; Lead Pitch: 4.5mm; Radiation Hardening: No; REACH SVHC: No SVHC; Supplier 2: Digikey; Supplier Part Number 2: 493-9631-6-ND; Category: Aluminum Electrolytic Capacitors; Pricing 2: 1=0.65, 10=0.455, 50=0.383, 100=0.3118 (USD); Number of Pins: 2; Package Shape: Cylindrical; Size Code: 4141; Terminal Finish: Tin; JESD-609 Code: e6; Capacitor Type: Aluminium; Negative Tolerance: 20%; Package Style: SMTMeter; Positive Tolerance: 20%; Rated DC Voltage (URdc): 100V; Width: 10.3mm; Reach SVHC Compliant: No; RoHS Compliant: Yes; ComponentLink1URL: https://datasheet.ciiva.com:443/pdfs/VipMasterIC/IC/NICH/NICH-S-A0009252175/NICH-S-A0009252175-1.pdf?src-supplier=IHS+Markit; ComponentLink1Description: https://datasheet.ciiva.com:443/pdfs/VipMasterIC/IC/NICH/NICH-S-A0009252175/NICH-S-A0009252175-1.pdf?src-supplier=IHS+Markit; ComponentLink2URL: https://datasheet.ciiva.com/30522/getdatasheetpartid-544485-30522138.pdf?src-supplier=Verical; ComponentLink2Description: https://datasheet.ciiva.com/30522/getdatasheetpartid-544485-30522138.pdf?src-supplier=Verical; ComponentLink3URL: https://datasheet.ciiva.com/11781/0900766b80fa3a40-11781984.pdf?src-supplier=Rs; ComponentLink3Description: https://datasheet.ciiva.com/11781/0900766b80fa3a40-11781984.pdf?src-supplier=Rs; ComponentLink4URL: https://datasheet.ciiva.com/5361/e-ux-11104-5361317.pdf?src-supplier=Mouser; ComponentLink4Description: https://datasheet.ciiva.com/5361/e-ux-11104-5361317.pdf?src-supplier=Mouser; ComponentLink5URL: https://datasheet.ciiva.com/7907/e-ux-7907500.pdf?src-supplier=Element14; ComponentLink5Description: https://datasheet.ciiva.com/7907/e-ux-7907500.pdf?src-supplier=Element14; ComponentLink6URL: https://datasheet.ciiva.com/28458/1913003-28458341.pdf?src-supplier=Element14; ComponentLink6Description: https://datasheet.ciiva.com/28458/1913003-28458341.pdf?src-supplier=Element14
C2 = CMP-03422-000882-1: Surface Mount Ceramic Multilayer Capacitor 0.33uF 10% X7R 16V 0805 Blister T/R; Manufacturer: Yageo; Tolerance: 0.1; Height: 0.95mm; Automotive: No; Footprint Url: http://www.yageo.com/exep/pages/download/literatures/UPY-C_GEN_24.pdf; Temperature Characteristic: X7R; Device Class L3: Ceramic Capacitors; Category: Cap; Temperature Range High: +85°C; Manufacturer Part Number: CC0805KKX7R7BB334; Temperature Range Low: -30°C; ComponentLink2URL: http://www.yageo.com/documents/recent/UPY-GPHC_Y5V_6.3V-to-50V_8.pdf; Lead Free: Yes; Device Class L2: Capacitors; Package: CC0805-0.85; Material: Ceramic; Voltage Rating: 16 V; Device Class L1: Passive Components; Ipc Land Pattern Name: CAPC200125X85; Mouser Description: Multilayer Ceramic Capacitors MLCC - SMD/SMT 330nF 16V X7R 10%; Octopart: https://octopart.com/cc0805kkx7r7bb334-yageo-42334127; Capacitance: 330 nF; Temperature: -30°C to +85°C; ComponentLink2Description: Datasheet; Digikey Description: Surface Mount Ceramic Multilayer Capacitor 0.33uF 10% X7R 16V 0805 Blister T/R; RoHS: TRUE
C3 = CMP-2006-03300-1: Manufacturer: Kemet; Dielectric Material: Ceramic; Tolerance: 10%; Dielectric: X7R; Dissipation Factor: 2.5%; Part Number: C0603X104K5RACTU; Supplier 1: Digi-Key; Supplier Part Number 1: 399-7969-1-ND; Manufacturer Part Number: C0603X104K5RACTU; Stock 1: 2206541; Pricing 1: 1 = 0.21000, 10 = 0.14500, 100 = 0.07340, 500 = 0.05024, 1000 = 0.04444 (USD); RoHS: Yes; Mount: Surface Mount; Case/Package: 0603; Number of Pins: 2; Case Code (Metric): 1608; Min Operating Temperature: -55°C; Max Operating Temperature: 125°C; Voltage Rating: 50V; Packaging: Tape and Reel; Package Quantity: 1; Voltage Rating (DC): 50V; Termination: SMD/SMT; Features: Soft Termination; Length: 1.6mm; Height: 0.8mm; Width: 0.8mm; Depth: 0.8mm; Thickness: 0.034inch; Radiation Hardening: No; REACH SVHC: No SVHC; ComponentLink1URL: https://datasheet.ciiva.com/7823/1776088-7823908.pdf?src-supplier=Element14; ComponentLink1Description: https://datasheet.ciiva.com/7823/1776088-7823908.pdf?src-supplier=Element14; ComponentLink2URL: https://datasheet.ciiva.com/26948/getdatasheetpartid-385607-26948458.pdf?src-supplier=Verical; ComponentLink2Description: https://datasheet.ciiva.com/26948/getdatasheetpartid-385607-26948458.pdf?src-supplier=Verical; ComponentLink3URL: https://datasheet.ciiva.com/7823/1776088-7823909.pdf?src-supplier=Element14; ComponentLink3Description: https://datasheet.ciiva.com/7823/1776088-7823909.pdf?src-supplier=Element14; ComponentLink4URL: https://datasheet.ciiva.com/6279/kem-c1013-x7r-ft-cap-smd-6279993.pdf?src-supplier=Digi-Key; ComponentLink4Description: https://datasheet.ciiva.com/6279/kem-c1013-x7r-ft-cap-smd-6279993.pdf?src-supplier=Digi-Key; ComponentLink5URL: https://datasheet.ciiva.com/28533/1918693-28533212.pdf?src-supplier=Element14; ComponentLink5Description: https://datasheet.ciiva.com/28533/1918693-28533212.pdf?src-supplier=Element14; ComponentLink6URL: https://datasheet.ciiva.com/6279/kem-c1013-x7r-ft-cap-smd-6279999.pdf?src-supplier=Digi-Key; ComponentLink6Description: https://datasheet.ciiva.com/6279/kem-c1013-x7r-ft-cap-smd-6279999.pdf?src-supplier=Digi-Key; ComponentLink7URL: https://datasheet.ciiva.com/6279/kem-c1013-x7r-ft-cap-smd-6279990.pdf?src-supplier=Digi-Key; ComponentLink7Description: https://datasheet.ciiva.com/6279/kem-c1013-x7r-ft-cap-smd-6279990.pdf?src-supplier=Digi-Key; ComponentLink8URL: https://datasheet.ciiva.com/14597/70096394-14597743.pdf?src-supplier=Allied+Electronics; ComponentLink8Description: https://datasheet.ciiva.com/14597/70096394-14597743.pdf?src-supplier=Allied+Electronics
DS1 = CMP-2000-05062-1: as DS2 on sheet Ethernet; Operating Temperature Max: 85degC; Datasheet Version: Oct-08; MSL: MSL2A-4weeks; Peak Forward Current: 20mA; Package Description: 2-Pin Surface Mount Device, Body 2 x 1.25 mm, Height 0.8 mm; Datasheet URL: https://datasheet.ciiva.com/29280/180495-da-01-en-chip-led-hsmg-c170-gelb-gruen-29280971.pdf; Storage Temperature Min: -40degC; LED Colour: Green; Wavelength Typ: 570nm; Mounting Type: SMD; Forward Current If Max: 20mA; Dominant Wavelength Typ: 572nm; LED Mounting: SMD; Operating Temperature Range: -30degCto+85degC; Operating Temperature Min: -30degC; Manufacturer URL: http://www.avagotech.com/; Packaging: CutTape; Luminous Intensity Typ: 15mcd; Package Reference: HSMX-C170; Storage Temperature Max: 85degC; Opto Case Style: SMD; Forward Voltage: 2.2V
GND = CMP-1672-00003-4: Test Point, Black, Through Hole, RoHS, Bulk; Manufacturer: Keystone; ComponentLink2URL: http://www.keyelco.com/product-pdf.cfm?p=1320; Colour: Black; Pins: 1; REACH SVHC: No SVHC; ComponentLink1URL: http://www.keyelco.com/; PackageReference: 5011; Contact Plating: Silver; Package Quantity: 100; Packaging: Bulk; RoHSCompliant: true; Height: 8.12 mm; PackageDescription: 1-Pin Through Hole Device, Dia 3.17 mm; Mount: Through Hole; Mounting Technology: Through Hole; DatasheetVersion: Rev. F, 12/2013; ComponentLink1Description: Manufacturer URL; Contact Material: Bronze; ComponentLink2Description: Datasheet
R1 = CMP-2004-00107-1: Manufacturer: Vishay Dale; Part Number: CRCW0201143RFNED
U1 = CMP-04917-000046-1: IC REG LINEAR 3.3V 500MA TO252-3; Manufacturer: Texas Instruments; Nominal Supply Current: 4.5mA; Output Type: Fixed; Dropout Voltage: 2V; Number Of Outputs: 1; Max Supply Voltage: 25V; Standoff Height: 0mm; Max Junction Temp: +125°C; Accuracy Percentage: 3%; Min Supply Voltage: 5.3V; Temperature: 0°C to +125°C; Automotive: No; Package: KVU0003A; Category: IC; Output Current: 500mA; RoHS: TRUE; ComponentLink2Description: Datasheet; ComponentLink2URL: http://www.ti.com/lit/ds/symlink/ua78m.pdf; Height: 2.65mm; Output Voltage: 3.3V; Octopart: https://octopart.com/ua78m33ckvurg3-texas+instruments-669262; Mouser Description: Linear Voltage Regulators 3.3 V 500mA Fix Pos Voltage Regulator; Device Class L3: Voltage Regulators - Linear; Lead Free: Yes; Device Class L2: Power Management ICs; Device Class L1: Integrated Circuits (ICs); Digikey Description: IC REG LINEAR 3.3V 500MA TO252-3; Temperature Range Low: 0°C; Manufacturer Part Number: UA78M33CKVURG3; Temperature Range High: +125°C

## Nets that join several sheets
12V: MainConnector (J3.13), Power (12V.1 C1.1 C2.1 U1.1)
AVDD33: MicroSD (7 pins), Programming (J1.8 R4.2), U_VehicleCAN (C24A.1 U3A.3 U3A.5), Processor (24 pins), U_ChargerCAN (C24B.1 U3B.3 U3B.5), IMU (7 pins), Ethernet (25 pins), Power (3.3V.1 C3.2 DS1.1 U1.3)
GND: MicroSD (9 pins), Programming (8 pins), U_VehicleCAN (C24A.2 D3A.3 U3A.2 U3A.8), Oscillator (C20.1 C21.1), Processor (21 pins), MainConnector (J3.12 J3.14 R41.1), U_ChargerCAN (C24B.2 D3B.3 U3B.2 U3B.8), IMU (7 pins), Ethernet (26 pins), Power (6 pins)
CAN_CONN_H: U_VehicleCAN (D3A.2 U3A.7), MainConnector (J3.6)
CAN_CONN_H: MainConnector (J3.7), U_ChargerCAN (D3B.2 U3B.7)
CAN_CONN_L: U_VehicleCAN (D3A.1 U3A.6), MainConnector (J3.1)
CAN_CONN_L: MainConnector (J3.2), U_ChargerCAN (D3B.1 U3B.6)
MII_MDC: Processor (U2.16), Ethernet (IC2.31)
MII_MDIO: Processor (U2.25), Ethernet (IC2.30 R25.1)
NetC20_2: Oscillator (C20.2 Y1.1), Processor (U2.12)
NetIC1_1: Processor (U2.97), IMU (IC1.1)
NetIC1_12: Processor (U2.98), IMU (IC1.12)
NetIC1_13: Processor (U2.2), IMU (IC1.13)
NetIC1_16: Processor (U2.93), IMU (IC1.16)
NetIC2_7: Processor (U2.56), Ethernet (IC2.7)
NetIC2_29: Processor (U2.8), Ethernet (IC2.29 R24.1)
NetIC2_41: Processor (U2.30), Ethernet (IC2.41)
NetJ3_3: Processor (R3.1 U2.95), MainConnector (J3.3 J3.4), IMU (R6.1)
NetJ3_5: Processor (U2.4), MainConnector (J3.5)
NetJ3_8: Processor (R2.1 U2.96), MainConnector (J3.8 J3.9), IMU (R9.2)
NetR5_1: Oscillator (R5.1), Processor (U2.13)
NetR14_1: Processor (U2.51), Ethernet (R14.1)
NetR15_1: Processor (U2.33), Ethernet (R15.1)
NetR16_1: Processor (U2.52), Ethernet (R16.1)
NetR17_1: Processor (U2.34), Ethernet (R17.1)
NetR18_1: Processor (U2.17), Ethernet (R18.1)
NetR19_1: Processor (U2.35), Ethernet (R19.1)
NetR20_1: Processor (U2.1), Ethernet (R20.1)
NetR21_1: Processor (U2.36), Ethernet (R21.1)
NetR22_1: Processor (U2.18), Ethernet (R22.1)
NetR23_1: Processor (U2.48), Ethernet (R23.1)
NetR26_1: Processor (U2.23), Ethernet (R26.1)
NetR27_1: Processor (U2.32), Ethernet (R27.1)
NetR28_1: Processor (U2.24), Ethernet (R28.1)
NetR29_1: Processor (U2.26), Ethernet (R29.1)
NetR48_2: MicroSD (R48.2 R49.1), Processor (U2.67)
NetU2_81: U_VehicleCAN (U3A.4), Processor (U2.81)
NetU2_82: U_VehicleCAN (U3A.1), Processor (U2.82)
NetU2_91: Processor (U2.91), U_ChargerCAN (U3B.4)
NetU2_92: Processor (U2.92), U_ChargerCAN (U3B.1)
RESET: Programming (6 pins), Processor (U2.14)
SD_CK: MicroSD (J4.P5), Processor (U2.80)
SD_CMD: MicroSD (J4.P3 R47.1), Processor (U2.83)
SD_D0: MicroSD (J4.P7 R43.1), Processor (U2.65)
SD_D1: MicroSD (J4.P8 R44.1), Processor (U2.66)
SD_D2: MicroSD (J4.P1 R45.1), Processor (U2.78)
SD_D3: MicroSD (J4.P2 R46.1), Processor (U2.79)
SWCLK: Programming (D1.3 J1.6), Processor (U2.76)
SWDIO: Programming (D1.1 J1.7), Processor (U2.72)
UART_DGB2MCU: Programming (D2.1 J1.3), Processor (U2.69)
UART_MCU2DGB: Programming (D2.3 J1.2), Processor (U2.68)
USB_BOARD_N: MicroSD (J5.2), Processor (U2.70)
USB_BOARD_P: MicroSD (J5.3), Processor (U2.71)

## Assembly variants
2024_TCU: not fitted R7 R10 R13